# EAGLE schematic SANE v2 (EAGLE 7.6.0)
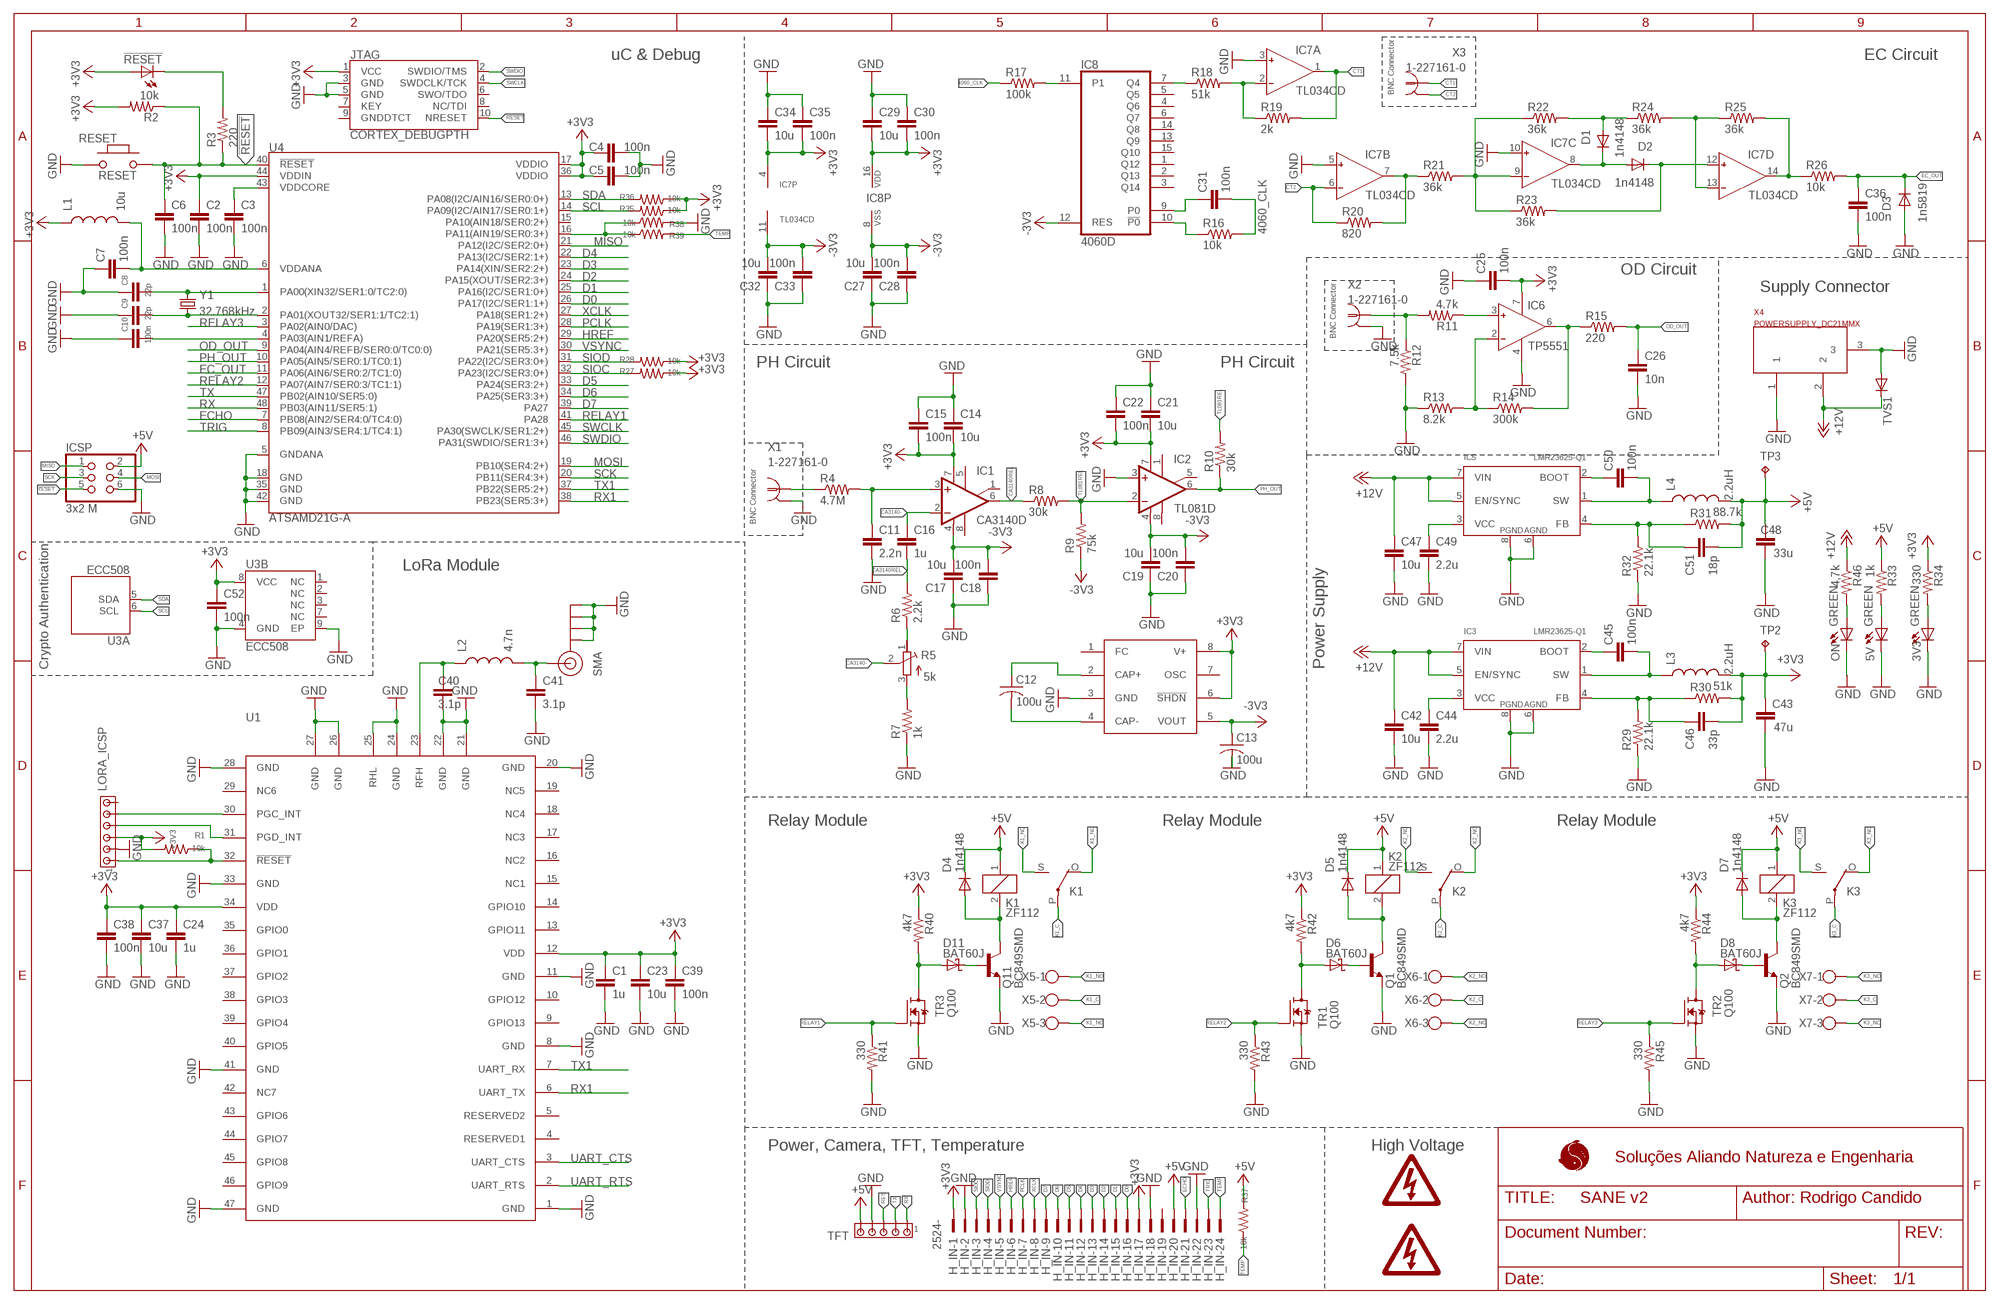
[diagram p0: schematic, sheet 1]

## Parts
3V3  GREEN  LEDCHIP-LED0805  [CHIP-LED0805]
5V  GREEN  LEDCHIP-LED0805  [CHIP-LED0805]
!RESET  LEDCHIPLED_0805  [CHIPLED_0805]
C1  1u  C-EUC1206  [C1206]
C2  100n  C-EUC0805  [C0805]
C3  100n  C-EUC0805  [C0805]
C4  100n  C-EUC0805  [C0805]
C5  100n  C-EUC0805  [C0805]
C6  100n  C-EUC0805  [C0805]
C7  100n  C-EUC0805  [C0805]
C8  22p  C-EUC0805  [C0805]
C9  22p  C-EUC0805  [C0805]
C10  100n  C-EUC0805  [C0805]
C11  2.2n  C-EUC0805  [C0805]
C12  100u  C-USC1206  [C1206]
C13  100u  C-USC1206  [C1206]
C14  10u  C-EUC1206  [C1206]
C15  100n  C-EUC0805  [C0805]
C16  1u  C-EUC1206  [C1206]
C17  10u  C-EUC1206  [C1206]
C18  100n  C-EUC0805  [C0805]
C19  10u  C-EUC1206  [C1206]
C20  100n  C-EUC0805  [C0805]
C21  10u  C-EUC1206  [C1206]
C22  100n  C-EUC0805  [C0805]
C23  10u  C-EUC1206  [C1206]
C24  1u  C-EUC1206  [C1206]
C25  100n  C-EUC0805  [C0805]
C26  10n  C-EUC0805  [C0805]
C27  10u  C-EUC1206  [C1206]
C28  100n  C-EUC0805  [C0805]
C29  10u  C-EUC1206  [C1206]
C30  100n  C-EUC0805  [C0805]
C31  100n  C-EUC0805  [C0805]
C32  10u  C-EUC1206  [C1206]
C33  100n  C-EUC0805  [C0805]
C34  10u  C-EUC1206  [C1206]
C35  100n  C-EUC0805  [C0805]
C36  100n  C-EUC0805  [C0805]
C37  10u  C-EUC1206  [C1206]
C38  100n  C-EUC0805  [C0805]
C39  100n  C-EUC0805  [C0805]
C40  3.1p  C-EUC0603  [C0603]
C41  3.1p  C-EUC0603  [C0603]
C42  10u  C-EUC1206  [C1206]
C43  47u  C-EUC1206  [C1206]
C44  2.2u  C-EUC0805  [C0805]
C45  100n  C-EUC0805  [C0805]
C46  33p  C-EUC0805  [C0805]
C47  10u  C-EUC1206  [C1206]
C48  33u  C-EUC1206  [C1206]
C49  2.2u  C-EUC0805  [C0805]
C50  100n  C-EUC0805  [C0805]
C51  18p  C-EUC0805  [C0805]
C52  100n  C-EUC0805  [C0805]
D1  1n4148  DIODE-SOD123  [SOD123]
D2  1n4148  DIODE-SOD123  [SOD123]
D3  1n5819  DIODE-SOD123  [SOD123]
D4  1n4148  DIODE-SOD123  [SOD123]
D5  1n4148  DIODE-SOD123  [SOD123]
D6  BAT60J  [SOD323_ST]
D7  1n4148  DIODE-SOD123  [SOD123]
D8  BAT60J  [SOD323_ST]
D11  BAT60J  [SOD323_ST]
H_IN  2524-  [PAK100/2500-24]
IC1  CA3140D  [SO08]
IC2  TL081D  [SO08]
IC3  LMR23625-Q1  [SO08]
IC4  TC1121COA  [SO8]
IC5  LMR23625-Q1  [SO08]
IC6  TP5551  [SO8]
IC7  TL034CD  [SO14]
IC8  4060D  [SO16]
ICSP  3x2 M  ICSP  [2X03]
JTAG  CORTEX_DEBUGPTH  [2X5-PTH-1.27MM]
K1  ZF112  [ZF112]
K2  ZF112  [ZF112]
K3  ZF112  [ZF112]
L1  10u  INDUCTOR0603  [0603]
L2  4.7n  INDUCTOR0603  [0603]
L3  2.2uH  L-NR3010  [L-NR3010]
L4  2.2uH  L-NR3010  [L-NR3010]
LORA_ICSP  MTA06-100  [10X06MTA]
ON  GREEN  LEDCHIP-LED0805  [CHIP-LED0805]
Q1  BC849SMD  [SOT23-BEC]
Q2  BC849SMD  [SOT23-BEC]
Q11  BC849SMD  [SOT23-BEC]
R1  10k  R-US_R0805  [R0805]
R2  10k  R-US_R0805  [R0805]
R3  220  R-US_R0805  [R0805]
R4  4.7M  R-US_R0805  [R0805]
R5  5k  R-TRIMMT93YA  [RTRIMT93YA]
R6  2.2k  R-US_R0805  [R0805]
R7  1k  R-US_R0805  [R0805]
R8  30k  R-US_R0805  [R0805]
R9  75k  R-US_R0805  [R0805]
R10  30k  R-US_R0805  [R0805]
R11  4.7k  R-US_R0805  [R0805]
R12  7.5k  R-US_R0805  [R0805]
R13  8.2k  R-US_R0805  [R0805]
R14  300k  R-US_R0805  [R0805]
R15  220  R-US_R0805  [R0805]
R16  10k  R-US_R0805  [R0805]
R17  100k  R-US_R0805  [R0805]
R18  51k  R-US_R0805  [R0805]
R19  2k  R-US_R0805  [R0805]
R20  820  R-US_R0805  [R0805]
R21  36k  R-US_R0805  [R0805]
R22  36k  R-US_R0805  [R0805]
R23  36k  R-US_R0805  [R0805]
R24  36k  R-US_R0805  [R0805]
R25  36k  R-US_R0805  [R0805]
R26  10k  R-US_R0805  [R0805]
R27  10k  R-US_R0805  [R0805]
R28  10k  R-US_R0805  [R0805]
R29  22.1k  R-US_R0603  [R0603]
R30  51k  R-US_R0603  [R0603]
R31  88.7k  R-US_R0603  [R0603]
R32  22.1k  R-US_R0603  [R0603]
R33  1k  R-US_R0805  [R0805]
R34  330  R-US_R0805  [R0805]
R35  10k  R-US_R0805  [R0805]
R36  10k  R-US_R0805  [R0805]
R37  10k  R-US_R0805  [R0805]
R38  10k  R-US_R0805  [R0805]
R39  10k  R-US_R0805  [R0805]
R40  4k7  R-US_R0805  [R0805]
R41  330  R-US_R0805  [R0805]
R42  4k7  R-US_R0805  [R0805]
R43  330  R-US_R0805  [R0805]
R44  4k7  R-US_R0805  [R0805]
R45  330  R-US_R0805  [R0805]
R46  4,7k  R-US_R0805  [R0805]
RESET  RESET  0173_IT-1185AP1C-160G-G_T&R  [SMD_157SW]
SMA_GPS  SMA_EDGE  [SMA-EDGE]
TFT  MTA05-100  [10X05MTA]
TP2  TPPAD1-13  [P1-13]
TP3  TPPAD1-13  [P1-13]
TR1  Q100  1612_2N7002LT1G  [SOT-23]
TR2  Q100  1612_2N7002LT1G  [SOT-23]
TR3  Q100  1612_2N7002LT1G  [SOT-23]
TVS1  DIODE-SOD123  [SOD123]
U1  RN2483/RN2903  [RN2483/RN2903]
U3  ECC508  ATECC508A-MAHDA-T8-UDFN  [SON50P300X200X60-9N-EP160X140]
U4  ATSAMD21G-A  [TQFP-48]
U$1  SHOCK  [SHOCK]
U$2  SHOCK  [SHOCK]
U$3  LOGO-SANE  [LOGO-SANE]
U$9  SHOCK  [SHOCK]
X1  1-227161-0  [AMP_227161]
X2  1-227161-0  [AMP_227161]
X3  1-227161-0  [AMP_227161]
X4  POWERSUPPLY_DC21MMX  [POWERSUPPLY_DC-21MM]
X5  W237-103  [W237-103]
X6  W237-103  [W237-103]
X7  W237-103  [W237-103]
Y1  32.768kHz  CRYSTAL3.2X1.5MM  [CRYSTAL-SMD-3.2X1.5MM]

## Nets
4060_CLK: C31.2 R16.2 R17.1
!RESET: C6.1 ICSP.5 JTAG.10(NRESET) R2.1 R3.1 RESET.2 U4.40(!RESET!)
+3V3: !RESET.A C1.1 C2.1 C4.1 C5.1 C14.2 C15.2 C21.2 C22.2 C23.1 C24.1 C25.2 C29.2 C30.2 C34.2 C35.2 C37.1 C38.1 C39.1 C43.2 C46.2 C52.1 H_IN.1 H_IN.17 IC1.7(V+) IC2.7(V+) IC4.6(!SHDN) IC4.8(V+) IC6.7(V+) IC7.4(P:V+) IC8.16(VDD) JTAG.1(VCC) L1.1 L3.P$2 LORA_ICSP.3 R1.2 R2.2 R27.1 R28.1 R30.2 R34.1 R35.1 R36.1 R40.1 R42.1 R44.1 TP2.TP U1.12(VDD) U1.34(VDD) U3.8(B:VCC) U4.17(VDDIO) U4.36(VDDIO) U4.44(VDDIN)
+5V: C48.2 C51.2 D4.C D5.C D7.C H_IN.20 ICSP.2 K1.1 K2.1 K3.1 L4.P$2 R31.2 R33.1 R37.2 TFT.5 TP3.TP
+12V: C42.1 C47.1 IC3.5(EN/SYNC) IC3.7(VIN) IC5.5(EN/SYNC) IC5.7(VIN) R46.1 TVS1.C X4.2
-3V3: C13.1 C17.2 C18.2 C19.2 C20.2 C27.2 C28.2 C32.2 C33.2 IC1.4(V-) IC2.4(V-) IC4.5(VOUT) IC7.11(P:V-) IC8.8(VSS) IC8.12(RES) R9.1
CA3140-: C16.1 IC1.2(-IN) R5.2(S)
CA3140REL: C16.2 IC1.6(OUT) R6.2 R8.1
CT1: IC7.1(A:OUT) R19.2 X3.1
CT2: IC7.6(B:IN-) R20.1 X3.2
D0: H_IN.16 U4.26(PA17(I2C/SER1:1+))
D1: H_IN.15 U4.25(PA16(I2C/SER1:0+))
D2: H_IN.14 U4.24(PA15(XOUT/SER2:3+))
D3: H_IN.13 U4.23(PA14(XIN/SER2:2+))
D4: H_IN.12 U4.22(PA13(I2C/SER2:1+))
D5: H_IN.11 U4.33(PA24(SER3:2+))
D6: H_IN.10 U4.34(PA25(SER3:3+))
D7: H_IN.9 U4.39(PA27)
EC_OUT: C36.1 D3.C R26.2 U4.11(PA06(AIN6/SER0:2/TC1:0))
ECHO: H_IN.21 U4.7(PB08(AIN2/SER4:0/TC4:0))
GND: 3V3.C 5V.C C1.2 C2.2 C3.2 C4.2 C5.2 C6.2 C7.1 C8.1 C9.1 C10.1 C11.2 C13.2 C14.1 C15.1 C17.1 C18.1 C19.1 C20.1 C21.1 C22.1 C23.2 C24.2 C25.1 C26.2 C27.1 C28.1 C29.1 C30.1 C32.1 C33.1 C34.1 C35.1 C36.2 C37.2 C38.2 C39.2 C40.2 C41.2 C42.2 C43.1 C44.2 C47.2 C48.1 C49.2 C52.2 D3.A H_IN.2 H_IN.18 H_IN.22 IC2.3(+IN) IC3.6(AGND) IC3.8(PGND) IC4.3(GND) IC5.6(AGND) IC5.8(PGND) IC6.4(V-) IC7.3(A:IN+) IC7.5(B:IN+) IC7.10(C:IN+) ICSP.6 JTAG.3(GND) JTAG.5(GND) LORA_ICSP.2 ON.C Q1.E Q2.E Q11.E R7.1 R12.2 R13.1 R29.1 R32.1 R38.2 R41.2 R43.2 R45.2 RESET.1 SMA_GPS.GND@0(GND) SMA_GPS.GND@1(GND) SMA_GPS.GND@2(GND) SMA_GPS.GND@3(GND) TFT.4 TR1.2(S) TR2.2(S) TR3.2(S) TVS1.A U1.1(GND) U1.8(GND) U1.11(GND) U1.20(GND) U1.21(GND) U1.22(GND) U1.24(GND) U1.25(RHL) U1.26(GND) U1.27(GND) U1.28(GND) U1.33(GND) U1.41(GND) U1.47(GND) U3.4(B:GND) U3.9(B:EP) U4.5(GNDANA) U4.18(GND) U4.35(GND) U4.42(GND) X1.2 X2.2 X4.1 X4.3
HREF: H_IN.6 U4.29(PA20(SER5:2+))
K1_C: K1.P(2:P) X5.2
K1_NC: K1.S(2:S) X5.3
K1_NO: K1.O(2:O) X5.1
K2_C: K2.P(2:P) X6.2
K2_NC: K2.S(2:S) X6.3
K2_NO: K2.O(2:O) X6.1
K3_C: K3.P(2:P) X7.2
K3_NC: K3.S(2:S) X7.3
K3_NO: K3.O(2:O) X7.1
MISO: ICSP.1 U4.21(PA12(I2C/SER2:0+))
MOSI: ICSP.4 U4.19(PB10(SER4:2+))
N$1: C3.1 U4.43(VDDCORE)
N$2: C8.2 U4.1(PA00(XIN32/SER1:0/TC2:0)) Y1.P$2
N$3: C10.2 U4.4(PA03(AIN1/REFA))
N$4: !RESET.C R3.2
N$5: C9.2 U4.2(PA01(XOUT32/SER1:1/TC2:1)) Y1.P$1
N$6: C7.2 L1.2 U4.6(VDDANA)
N$7: R4.1 X1.1
N$8: C11.1 IC1.3(+IN) R4.2
N$9: C12.1 IC4.2(CAP+)
N$10: C12.2 IC4.4(CAP-)
N$11: R11.2 R12.1 X2.1
N$12: IC6.3(IN+) R11.1
N$13: R5.1(E) R6.1
N$14: R5.3(A) R7.2
N$15: IC8.10(!P0) R16.1
N$16: IC6.2(IN-) R13.2 R14.1
N$17: IC6.6(OUT) R14.2 R15.1
N$18: C31.1 IC8.9(P0)
N$19: IC7.2(A:IN-) R18.2 R19.1
N$20: IC8.11(P1) R17.2
N$21: IC8.7(Q4) R18.1
N$22: IC7.9(C:IN-) R21.2 R22.1 R23.1
N$23: IC7.7(B:OUT) R20.2 R21.1
N$24: D1.A R22.2 R24.1
N$25: D1.C D2.A IC7.8(C:OUT)
N$26: D2.C IC7.12(D:IN+) R23.2
N$27: IC7.13(D:IN-) R24.2 R25.1
N$28: IC7.14(D:OUT) R25.2 R26.1
N$29: LORA_ICSP.1 R1.1 U1.32(!RESET)
N$30: LORA_ICSP.5 U1.30(PGC_INT)
N$31: LORA_ICSP.4 U1.31(PGD_INT)
N$32: C40.1 L2.1 U1.23(RFH)
N$33: C41.1 L2.2 SMA_GPS.SIG(SIGNAL)
N$34: C44.1 IC3.3(VCC)
N$35: C45.1 IC3.2(BOOT)
N$36: C45.2 IC3.1(SW) L3.P$1
N$37: C46.1 IC3.4(FB) R29.2 R30.1
N$38: C49.1 IC5.3(VCC)
N$39: C50.1 IC5.2(BOOT)
N$40: C50.2 IC5.1(SW) L4.P$1
N$41: C51.1 IC5.4(FB) R31.1 R32.2
N$42: 5V.A R33.2
N$43: 3V3.A R34.2
N$44: R38.1 R39.1 U4.16(PA11(AIN19/SER0:3+))
N$45: D11.A R40.2 TR3.1(D)
N$46: D11.C Q11.B
N$48: D4.A K1.2 Q11.C
N$49: D6.A R42.2 TR1.1(D)
N$50: D6.C Q1.B
N$52: D5.A K2.2 Q1.C
N$53: D8.A R44.2 TR2.1(D)
N$54: D8.C Q2.B
N$56: D7.A K3.2 Q2.C
N$57: ON.A R46.2
OD_OUT: C26.1 R15.2 U4.9(PA04(AIN4/REFB/SER0:0/TC0:0))
PCLK: H_IN.7 U4.28(PA19(SER1:3+))
PH_OUT: IC2.6(OUT) R10.1 U4.10(PA05(AIN5/SER0:1/TC0:1))
RELAY1: R41.1 TR3.3(G) U4.41(PA28)
RELAY2: R43.1 TR1.3(G) U4.12(PA07(AIN7/SER0:3/TC1:1))
RELAY3: R45.1 TR2.3(G) U4.3(PA02(AIN0/DAC))
RES: TFT.3
RX: TFT.1 U4.48(PB03(AIN11/SER5:1))
RX1: U1.6(UART_TX) U4.38(PB23(SER5:3+))
SCK: ICSP.3 U4.20(PB11(SER4:3+))
SCL: R35.2 U3.6(A:SCL) U4.14(PA09(I2C/AIN17/SER0:1+))
SDA: R36.2 U3.5(A:SDA) U4.13(PA08(I2C/AIN16/SER0:0+))
SIOC: H_IN.3 R27.2 U4.32(PA23(I2C/SER3:0+))
SIOD: H_IN.4 R28.2 U4.31(PA22(I2C/SER3:0+))
SWCLK: JTAG.4(SWDCLK/TCK) U4.45(PA30(SWCLK/SER1:2+))
SWDIO: JTAG.2(SWDIO/TMS) U4.46(PA31(SWDIO/SER1:3+))
TEMP: H_IN.24 R37.1 R39.2
TL081REL: IC2.2(-IN) R8.2 R9.2 R10.2
TRIG: H_IN.23 U4.8(PB09(AIN3/SER4:1/TC4:1))
TX: TFT.2 U4.47(PB02(AIN10/SER5:0))
TX1: U1.7(UART_RX) U4.37(PB22(SER5:2+))
UART_CTS: U1.3(UART_CTS)
UART_RTS: U1.2(UART_RTS)
VSYNC: H_IN.5 U4.30(PA21(SER5:3+))
XCLK: H_IN.8 U4.27(PA18(SER1:2+))
Unconnected: H_IN.19 IC1.1(ON/CMP) IC1.5(ON) IC1.8(CMP) IC2.1(ON1) IC2.5(ON2) IC2.8(OPT) IC4.1(FC) IC4.7(OSC) IC8.1(Q12) IC8.2(Q13) IC8.3(Q14) IC8.4(Q6) IC8.5(Q5) IC8.6(Q7) IC8.13(Q9) IC8.14(Q8) IC8.15(Q10) JTAG.6(SWO/TDO) JTAG.7(KEY) JTAG.8(NC/TDI) JTAG.9(GNDDTCT) LORA_ICSP.6 U1.4(RESERVED1) U1.5(RESERVED2) U1.9(GPIO13) U1.10(GPIO12) U1.13(GPIO11) U1.14(GPIO10) U1.15(NC1) U1.16(NC2) U1.17(NC3) U1.18(NC4) U1.19(NC5) U1.29(NC6) U1.35(GPIO0) U1.36(GPIO1) U1.37(GPIO2) U1.38(GPIO3) U1.39(GPIO4) U1.40(GPIO5) U1.42(NC7) U1.43(GPIO6) U1.44(GPIO7) U1.45(GPIO8) U1.46(GPIO9) U3.1(B:NC) U3.2(B:NC) U3.3(B:NC) U3.7(B:NC) U4.15(PA10(AIN18/SER0:2+))

## Notes on the sheet
- uC & Debug | EC Circuit
- BNC Connector
- OD Circuit
- Supply Connector
- BNC Connector
- PH Circuit | PH Circuit
- BNC Connector
- LoRa Module
- SMA
- Crypto Authentication | Power Supply
- Relay Module | Relay Module | Relay Module
- Power, Camera, TFT, Temperature | High Voltage
- Soluções Aliando Natureza e Engenharia
- Author: Rodrigo Candido

## Library data of the parts
3V3 5V !RESET ON = led:LED: LED OSRAM: - CHIPLED LG R971, LG N971, LY N971, LG Q971, LY Q971, LO R971, LY R971 LH N974, LH R974 LS Q976, LO Q976, LY Q976 LO Q996 - Hyper CHIPLED LW Q18S LB Q993, LB Q99A, LB R99A - SideLED LS A670, LO A670, LY A670, LG A670, LP A670 LB A673, LV A673, LT A673, LW A673 LH A674 LY A675 LS A676, LA A676, LO A676, LY A676, LW A676 LS A679, LY A679, LG A679 - Hyper Micro SIDELED® LS Y876, LA Y876, LO Y876, LY Y876 LT Y87S - SmartLED LW L88C, LW L88S LB L89C, LB L89S, LG L890 LS L89K, LO L89K, LY L89K LS L896, LA L896, LO L896, LY L896 - TOPLED LS T670, LO T670, LY T670, LG T670, LP T670 LSG T670, LSP T670, LSY T670, LOP T670, LYG T670 LG T671, LOG T671, LSG T671 LB T673, LV T673, LT T673, LW T673 LH T674 LS T676, LA T676, LO T676, LY T676, LB T676, LH T676, LSB T676, LW T676 LB T67C, LV T67C, LT T67C, LS T67K, LO T67K, LY T67K, LW E67C LS E67B, LA E67B, LO E67B, LY E67B, LB E67C, LV E67C, LT E67C LW T67C LS T679, LY T679, LG T679 LS T770, LO T770, LY T770, LG T770, LP T770 LB T773, LV T773, LT T773, LW T773 LH T774 LS E675, LA E675, LY E675, LS T675 LS T776, LA T776, LO T776, LY T776, LB T776 LHGB T686 LT T68C, LB T68C - Hyper Mini TOPLED® LB M676 - Mini TOPLED Santana® LG M470 LS M47K, LO M47K, LY M47K Source: http://www.osram.convergy.de LUXEON: - LUMILED® LXK2-PW12-R00, LXK2-PW12-S00, LXK2-PW14-U00, LXK2-PW14-V00 LXK2-PM12-R00, LXK2-PM12-S00, LXK2-PM14-U00 LXK2-PE12-Q00, LXK2-PE12-R00, LXK2-PE12-S00, LXK2-PE14-T00, LXK2-PE14-U00 LXK2-PB12-K00, LXK2-PB12-L00, LXK2-PB12-M00, LXK2-PB14-N00, LXK2-PB14-P00, LXK2-PB14-Q00 LXK2-PR12-L00, LXK2-PR12-M00, LXK2-PR14-Q00, LXK2-PR14-R00 LXK2-PD12-Q00, LXK2-PD12-R00, LXK2-PD12-S00 LXK2-PH12-R00, LXK2-PH12-S00 LXK2-PL12-P00, LXK2-PL12-Q00, LXK2-PL12-R00 Source: www.luxeon.com KINGBRIGHT: KA-3528ASYC Source: www.kingbright.com
C1-C11 C14-C52 = rcl:C-EU: CAPACITOR, European symbol
C12 C13 = rcl:C-US: CAPACITOR, American symbol
D1-D5 D7 TVS1 = diode:DIODE-: DIODE
D6 D8 D11 = diode:BAT60J: Schottky barrier diode Source: www.st.com, BAT60J.pdf
H_IN = con-3m:2524-: 3M (TM) Pak 100 4-Wall Header Source: 3M; OC_FARNELL: unknown; OC_NEWARK: unknown
IC1 = linear:CA3140: OP AMP
IC2 = linear:TL081: OP AMP
IC3 IC5 = componentes telemetria:LMR23625-Q1; MF: Texas Instruments; MPN: LMR23625-Q1
IC4 = sane_lbr:TC1121COA
IC6 = sane_lbr:TP5551
IC7 = sane_lbr:TL034CD
IC8 = 40xx:4060: 14-stage binary/ripple COUNTER
ICSP = Arduino:ICSP: PIN HEADER
JTAG = samd21-temp:CORTEX_DEBUG: Cortex Debug Connector Datasheet <http://infocenter.arm.com/help/topic/com.arm.doc.faqs/attached/13634/cortex_debug_connectors.pdf>
K1-K3 = relay:ZF112: RELAY 1 x switch; OC_FARNELL: unknown; OC_NEWARK: unknown
L1 L2 = SparkFun-Passives:INDUCTOR: Inductors Basic Inductor/Choke - 0603 and 1206. Footprints are not proven and vary greatly between part numbers. INDUCTOR POWER 3.3UH 4.0A SMD 0.197" L x 0.197" W x 0.177" H (5.00mm x 5.00mm x 4.50mm); PROD_ID: RES-07859
L3 L4 = MSP-EXP430F5659:L-NR3010
LORA_ICSP = con-amp:MTA06-100: AMP connector Connection corrected 2014-09-19
Q1 Q2 Q11 = transistor-npn:BC849*: NPN Transistor
R1-R4 R6-R32 R35-R45 = rcl:R-US_: RESISTOR, American symbol
R5 = resistor:R-TRIMM: Trimm resistor
R33 R34 R46 = resistor:R-US_: RESISTOR, American symbol
RESET = Switches:0173_IT-1185AP1C-160G-G_T&R: Pushbutton 4x3 SMD H2,5mm; MONTHLY_USAGE: _____; PART_NUMBER: IT-1185AP1C-160G-G_T&R; PRICE: _____; SUPPLIER: _____; TYPE: Switches; VALUE: 157SW
SMA_GPS = SparkFun:SMA_EDGE: SMA Antenna Connector End launch SMA connector. The paste layer has been removed so that the connector can be hand soldered onto the board after reflow.
TFT = con-amp:MTA05-100: AMP connector
TP2 TP3 = testpad:TP: Test pad
TR1-TR3 = Transistors:1612_2N7002LT1G: 2N7002 60 V, 300 mA N-channel Trench MOSFET; VALUE: 2N7002
U1 = SyncChannelCustom:RN2483/RN2903: MicroChip RN2483/RN2903 LoRaWAN Module Digikey Part Numbers: - RN2903-I/RM095-ND - RN2483-I/RM101-ND
U3 = Arduino-ICs:ATECC508A-MAHDA-T: Secure authentication and product validation device, EEPROM, I2C, 2.0 - 5.5V; DATASHEET: http://www.atmel.com/Images/Atmel-8923S-CryptoAuth-ATECC508A-Datasheet-Summary.pdf; DISTRIBUTOR-LINK: http://www.digikey.com/product-detail/en/atmel/ATECC508A-MAHDA-T/ATECC508A-MAHDA-TCT-ND/5213071; DISTRIBUTOR-PN: ATECC508A-MAHDA-TCT-ND; MANUFACTURER: Atmel; MANUFACTURER-PN: ATECC508A-MAHDA-T
U4 = samd21-temp:ATSAMD21G: Atmel SAMD21G SMART ARM-Based Microcontroller The Atmel ® | SMART ™ SAM D21 is a series of low-power microcontrollers using the 32-bit ARM ® Cortex ® -M0+ processor, and ranging from 32- to 64-pins with up to 256KB Flash and 32KB of SRAM. The SAM D21 devices operate at a maximum frequency of 48MHz and reach 2.46 CoreMark/MHz. They are designed for simple and intuitive migration with identical peripheral modules, hex compatible code, identical linear address map and pin compatible migration paths between all devices in the product series. All devices include intelligent and flexible peripherals, Atmel Event System for inter-peripheral signaling, and support for capacitive touch button, slider and wheel user interfaces.; PROD_ID: IC-13064
U$1 U$2 U$9 = logo:SHOCK
U$3 = logo-sane:LOGO-SANE
X1-X3 = con-coax:?227161*: JACK, RIGHT ANGLE, 50 OHM, PCB, BNC Source: amp_227161.pdf; MF: TYCO ELECTRONICS; MPN: 1-227161; OC_FARNELL: unknown; OC_NEWARK: 33B3200
X4 = SmartPrj:POWERSUPPLY_DC21MM
X5-X7 = con-wago-500:W237-103: WAGO SCREW CLAMP; MPN: 237-103; OC_FARNELL: unknown; OC_NEWARK: 18M7116
Y1 = samd21-temp:CRYSTAL: Various standard crystals. Proven footprints.; PROD_ID: XTAL-13062

## Net classes
0 default: width 0.203 mm, drill 0.406 mm, clearance 0.203 mm